# EAGLE schematic dcdc_mc34063_down_5to-5 (EAGLE 6.4)
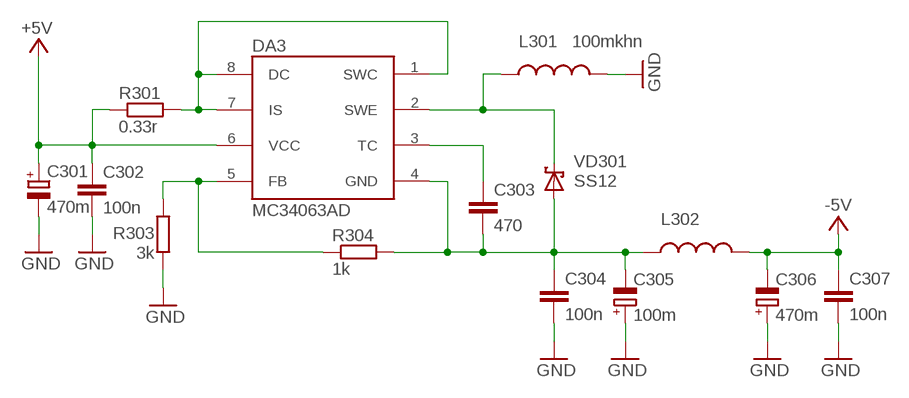
[diagram p0: schematic, sheet 1]

## Parts
C301  470m  CPOL-EUE3.5-8  [E3,5-8]
C302  100n  C-EUC0805  [C0805]
C303  470  C-EUC0805  [C0805]
C304  100n  C-EUC0805  [C0805]
C305  100m  CPOL-EUE2.5-5  [E2,5-5]
C306  470m  CPOL-EUE3.5-8  [E3,5-8]
C307  100n  C-EUC0805  [C0805]
DA3  MC34063AD  [SOIC8]
L301  100mkhn  L-USTFI0305  [TFI0305]
L302  L-US0204/7  [0204/7]
R301  0.33r  R-EU_M1206  [M1206]
R303  3k  R-EU_M0805  [M0805]
R304  1k  R-EU_M0805  [M0805]
VD301  SS12  SCHOTTKY-DIODESMD  [SMB]

## Nets
+5V: C301.+ C302.1 DA3.6(VCC) R301.1
-5V: C306.- C307.1 L302.2
GND: C301.- C302.2 C304.2 C305.+ C306.+ C307.2 L301.2 R303.1
N$1: DA3.1(SWC) DA3.7(IS) DA3.8(DC) R301.2
N$2: DA3.2(SWE) L301.1 VD301.C
N$4: C303.1 DA3.3(TC)
N$5: C303.2 C304.1 C305.- DA3.4(GND) L302.1 R304.2 VD301.A
N$7: DA3.5(FB) R303.2 R304.1

## Library data of the parts
C301 C305 C306 = rcl:CPOL-EU: POLARIZED CAPACITOR, European symbol
C302-C304 C307 = rcl:C-EU: CAPACITOR, European symbol
DA3 = mc34063-2:MC34063
L301 L302 = rcl:L-US: INDUCTOR, American symbol
R301 R303 R304 = rcl:R-EU_: RESISTOR, European symbol
VD301 = diode:SCHOTTKY-DIODE: Schottky Diode